# EAGLE schematic Colour sorting device PCB schematic (EAGLE 9.7.0)
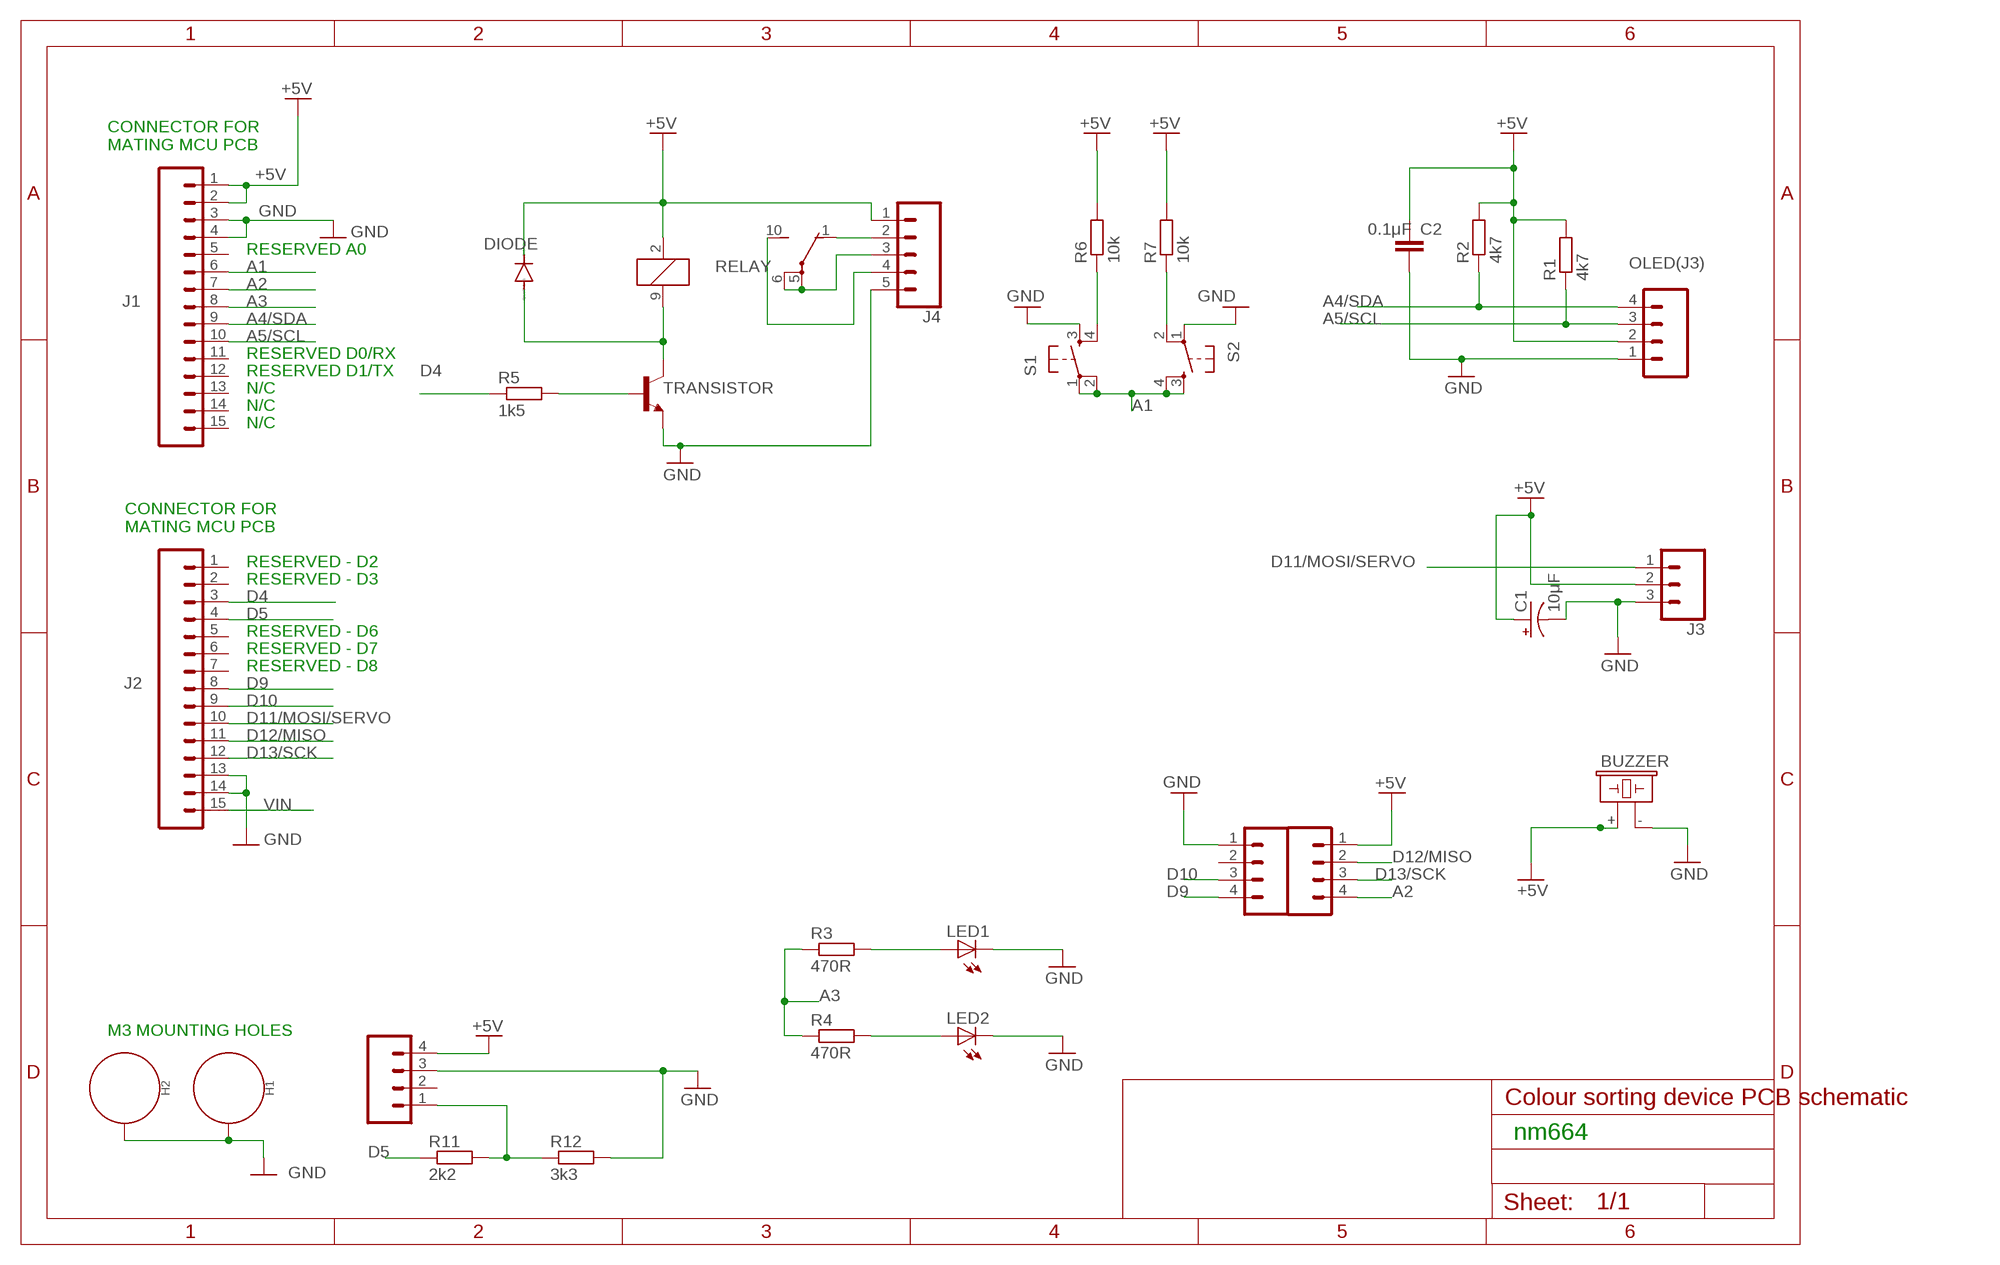
[diagram p0: schematic, sheet 1]

## Parts
BLUETOOTH  1X04_SMD_STRAIGHT_COMBO  CONN_04LONGPADS  [1X04_LONGPADS]
BUZZER  EL311_ATMEGA_INTRO_TSC033_V1_BUZZER_F/CM12P  [EL311_ATMEGA_INTRO_TSC033_V1_BUZZER_F/CM12P]
C1  10μF  CPOL-USE3.5-8  [E3,5-8]
C2  0.1μF  CAPACITOR-WIMA_C2.5/2  [CAPACITOR-WIMA_C2.5-2]
DIODE  DIODE_1N4004  [DIODE_DO41-10]
H1  STANDOFF_ELECTRICAL  [STANDOFF-ELECTRICAL]
H2  STANDOFF_ELECTRICAL  [STANDOFF-ELECTRICAL]
J1  CONN_15  [1X15]
J2  CONN_15  [1X15]
J3  1x3 RA Female .1"  CONN_03LONGPADS  [1X03_LONGPADS]
J4  CONN_05PTH_LONGPADS  [1X05_LONGPADS]
J5  1X04_SMD_STRAIGHT_COMBO  CONN_04LONGPADS  [1X04_LONGPADS]
LED1  ADAFRUIT_LED3MM  [ADAFRUIT_LED3MM]
LED2  ADAFRUIT_LED3MM  [ADAFRUIT_LED3MM]
OLED(J3)  1X04_SMD_STRAIGHT_COMBO  CONN_04LONGPADS  [1X04_LONGPADS]
R1  4k7  R-EU_0207/10  [0207/10]
R2  4k7  R-EU_0207/10  [0207/10]
R3  470R  R-EU_0207/10  [0207/10]
R4  470R  R-EU_0207/10  [0207/10]
R5  1k5  R-EU_0207/10  [0207/10]
R6  10k  R-EU_0207/10  [0207/10]
R7  10k  R-EU_0207/10  [0207/10]
R11  2k2  R-EU_0207/10  [0207/10]
R12  3k3  R-EU_0207/10  [0207/10]
RELAY  RELAY_G5V1  [RELAY_G5V1]
S1  EL311-ROBOT_SPARKFUN-ELECTROMECHANICAL_TAC_SWITCHPTH  [EL311-ROBOT_SPARKFUN-ELECTROMECHANICAL_TACTILE-PTH]
S2  EL311-ROBOT_SPARKFUN-ELECTROMECHANICAL_TAC_SWITCHPTH  [EL311-ROBOT_SPARKFUN-ELECTROMECHANICAL_TACTILE-PTH]
SENSORCONN1  1X04_SMD_STRAIGHT_COMBO  CONN_04LONGPADS  [1X04_LONGPADS]
TRANSISTOR  -NPN-TO92-EBC  [TO92-EBC]

## Nets
+5V [Power2]: BLUETOOTH.4 BUZZER.+ C1.+ C2.1 DIODE.C J1.1 J1.2 J3.2 J4.1 J5.1 OLED(J3).2 R1.2 R2.2 R6.2 R7.2 RELAY.2
A1: J1.6 S1.1 S1.2 S2.3 S2.4
A2: J1.7 J5.4
A3: J1.8 R3.1 R4.1
A4/SDA: J1.9 OLED(J3).4 R2.1
A5/SCL: J1.10 OLED(J3).3 R1.1
D4: J2.3 R5.1
D5: J2.4 R11.1
D9: J2.8 SENSORCONN1.4
D10: J2.9 SENSORCONN1.3
D11/MOSI/SERVO: J2.10 J3.1
D12/MISO: J2.11 J5.2
D13/SCK: J2.12 J5.3
GND [Power2]: BLUETOOTH.3 BUZZER.- C1.- C2.2 H1.P1 H2.P1 J1.3 J1.4 J2.13 J2.14 J3.3 J4.5 LED1.K(C) LED2.K(C) OLED(J3).1 R12.2 S1.3 S2.1 SENSORCONN1.1 TRANSISTOR.E
N$3: LED1.A R3.2
N$4: R5.2 TRANSISTOR.B
N$5: LED2.A R4.2
N$8: J4.4 RELAY.10(2:S)
N$9: J4.3 RELAY.5(2:P) RELAY.6(2:P)
N$10: J4.2 RELAY.1(2:O)
N$11: R6.1 S1.4
N$12: R7.1 S2.2
N$16: BLUETOOTH.1 R11.2 R12.1
N$17: DIODE.A RELAY.9 TRANSISTOR.C
VIN [Power2]: J2.15
Unconnected: BLUETOOTH.2 J1.5 J1.11 J1.12 J1.13 J1.14 J1.15 J2.1 J2.2 J2.5 J2.6 J2.7 SENSORCONN1.2

## Notes on the sheet
- CONNECTOR FOR
  MATING MCU PCB
- RESERVED A0
- RESERVED D0/RX
- RESERVED D1/TX
- N/C
- N/C
- N/C
- CONNECTOR FOR
  MATING MCU PCB
- RESERVED - D2
- RESERVED - D3
- RESERVED - D6
- RESERVED - D7
- RESERVED - D8
- M3 MOUNTING HOLES
- nm664

## Library data of the parts
BLUETOOTH J5 OLED(J3) SENSORCONN1 = EENG3110_V2_Library:CONN_04: Multi connection point. Often used as Generic Header-pin footprint for 0.1 inch spaced/style header connections On any of the 0.1 inch spaced packages, you can populate with these: Break Away Headers - Straight <https://www.sparkfun.com/products/116> (PRT-00116) Break Away Male Headers - Right Angle <https://www.sparkfun.com/products/553> (PRT-00553) Female Headers <https://www.sparkfun.com/products/115> (PRT-00115) Break Away Headers - Machine Pin <https://www.sparkfun.com/products/117> (PRT-00117) Break Away Female Headers - Swiss Machine Pin <https://www.sparkfun.com/products/743> (PRT-00743) For SCREWTERMINALS and SPRING TERMINALS visit here: Screw Terimnals on SparkFun.com <https://www.sparkfun.com/search/results?term=Screw+Terminals> (5mm/3.5mm/2.54mm spacing) This device is also useful as a general connection point to wire up your design to another part of your project. Our various solder wires solder well into these plated through hole pads. Hook-Up Wire - Assortment (Stranded, 22 AWG) <https://www.sparkfun.com/products/11375> (PRT-11375) Hook-Up Wire - Assortment (Solid Core, 22 AWG) <https://www.sparkfun.com/products/11367> (PRT-11367) View the entire wire category on our website here <https://www.sparkfun.com/categories/141> Special notes: Molex polarized connector foot print use with SKU : PRT-08231 with associated crimp pins and housings. 1MM SMD Version SKU: PRT-10208; PROD_ID: CONN-08511; SF_ID: PRT-12638
BUZZER = EENG3110_V2_Library:EL311_ATMEGA_INTRO_TSC033_V1_BUZZER_F/CM12P: BUZZER Source: Buerklin; OC_FARNELL: unknown; OC_NEWARK: unknown
C1 = EENG3110_V2_Library:CPOL-US: POLARIZED CAPACITOR, American symbol
C2 = EENG3110_V2_Library:CAPACITOR-WIMA_C: CAPACITOR naming: grid - package width
DIODE = EENG3110_V2_Library:DIODE_1N4004: DIODE general purpose rectifier, 1 A
H1 H2 = SparkFun-Hardware:STANDOFF_ELECTRICAL: Stand Off Drill holes with an electrical connection. For example, use these to ground your board to a chassis. Example SparkFun Products Screw - Phillips Head (1/4", 4-40, 10 pack) <https://www.sparkfun.com/products/10453> (PRT-10453) Screw - Phillips Head (1/2", 4-40, 10 pack) <https://www.sparkfun.com/products/10452> (PRT-10452) Screw - Phillips Head (3/4", 4-40, 10 pack) <https://www.sparkfun.com/products/10451> (PRT-10451) Screw - Phillips Head (1", 4-40, 10 pack) <https://www.sparkfun.com/products/10450> (PRT-10450)
J1 J2 = SparkFun-Connectors:CONN_15: Multi connection point. Often used as Generic Header-pin footprint for 0.1 inch spaced/style header connections On any of the 0.1 inch spaced packages, you can populate with these: Break Away Headers - Straight <https://www.sparkfun.com/products/116> (PRT-00116) Break Away Male Headers - Right Angle <https://www.sparkfun.com/products/553> (PRT-00553) Female Headers <https://www.sparkfun.com/products/115> (PRT-00115) Break Away Headers - Machine Pin <https://www.sparkfun.com/products/117> (PRT-00117) Break Away Female Headers - Swiss Machine Pin <https://www.sparkfun.com/products/743> (PRT-00743) For SCREWTERMINALS and SPRING TERMINALS visit here: Screw Terimnals on SparkFun.com <https://www.sparkfun.com/search/results?term=Screw+Terminals> (5mm/3.5mm/2.54mm spacing) This device is also useful as a general connection point to wire up your design to another part of your project. Our various solder wires solder well into these plated through hole pads. Hook-Up Wire - Assortment (Stranded, 22 AWG) <https://www.sparkfun.com/products/11375> (PRT-11375) Hook-Up Wire - Assortment (Solid Core, 22 AWG) <https://www.sparkfun.com/products/11367> (PRT-11367) View the entire wire category on our website here <https://www.sparkfun.com/categories/141> Special notes: Molex polarized connector foot print use with SKU : PRT-08231 with associated crimp pins and housings. 1MM SMD Version SKU: PRT-10208 NOTES ON THE VARIANTS LOCK and LOCK_LONGPADS... This footprint was designed to help hold the alignment of a through-hole component (i.e. 6-pin header) while soldering it into place. You may notice that each hole has been shifted either up or down by 0.005 of an inch from it's more standard position (which is a perfectly straight line). This slight alteration caused the pins (the squares in the middle) to touch the edges of the holes. Because they are alternating, it causes a "brace" to hold the component in place. 0.005 has proven to be the perfect amount of "off-center" position when using our standard breakaway headers. Although looks a little odd when you look at the bare footprint, once you have a header in there, the alteration is very hard to notice. Also,if you push a header all the way into place, it is covered up entirely on the bottom side.
J3 = EENG3110_V2_Library:CONN_03: Multi connection point. Often used as Generic Header-pin footprint for 0.1 inch spaced/style header connections On any of the 0.1 inch spaced packages, you can populate with these: Break Away Headers - Straight <https://www.sparkfun.com/products/116> (PRT-00116) Break Away Male Headers - Right Angle <https://www.sparkfun.com/products/553> (PRT-00553) Female Headers <https://www.sparkfun.com/products/115> (PRT-00115) Break Away Headers - Machine Pin <https://www.sparkfun.com/products/117> (PRT-00117) Break Away Female Headers - Swiss Machine Pin <https://www.sparkfun.com/products/743> (PRT-00743) Stackable Header - 3 Pin (Female, 0.1") <https://www.sparkfun.com/products/13875> (PRT-13875) For SCREWTERMINALS and SPRING TERMINALS visit here: Screw Terimnals on SparkFun.com <https://www.sparkfun.com/search/results?term=Screw+Terminals> (5mm/3.5mm/2.54mm spacing) This device is also useful as a general connection point to wire up your design to another part of your project. Our various solder wires solder well into these plated through hole pads. Hook-Up Wire - Assortment (Stranded, 22 AWG) <https://www.sparkfun.com/products/11375> (PRT-11375) Hook-Up Wire - Assortment (Solid Core, 22 AWG) <https://www.sparkfun.com/products/11367> (PRT-11367) View the entire wire category on our website here <https://www.sparkfun.com/categories/141> Special notes: Molex polarized connector foot print use with SKU : PRT-08232 with associated crimp pins and housings.; PROD_ID: CONN-10925; SF_ID: PRT-08235; SF_SKU: PRT-08433
J4 = EENG3110_V2_Library:CONN_05: Multi connection point. Often used as Generic Header-pin footprint for 0.1 inch spaced/style header connections On any of the 0.1 inch spaced packages, you can populate with these: Break Away Headers - Straight <https://www.sparkfun.com/products/116> (PRT-00116) Break Away Male Headers - Right Angle <https://www.sparkfun.com/products/553> (PRT-00553) Female Headers <https://www.sparkfun.com/products/115> (PRT-00115) Break Away Headers - Machine Pin <https://www.sparkfun.com/products/117> (PRT-00117) Break Away Female Headers - Swiss Machine Pin <https://www.sparkfun.com/products/743> (PRT-00743) For SCREWTERMINALS and SPRING TERMINALS visit here: Screw Terimnals on SparkFun.com <https://www.sparkfun.com/search/results?term=Screw+Terminals> (5mm/3.5mm/2.54mm spacing) This device is also useful as a general connection point to wire up your design to another part of your project. Our various solder wires solder well into these plated through hole pads. Hook-Up Wire - Assortment (Stranded, 22 AWG) <https://www.sparkfun.com/products/11375> (PRT-11375) Hook-Up Wire - Assortment (Solid Core, 22 AWG) <https://www.sparkfun.com/products/11367> (PRT-11367) View the entire wire category on our website here <https://www.sparkfun.com/categories/141> Special notes: Molex polarized connector foot print use with SKU : PRT-08231 with associated crimp pins and housings. 1MM SMD Version SKU: PRT-10208; PROD_ID: CONN-08528; SF_ID: GPS-08288
LED1 LED2 = EENG3110_V2_Library:ADAFRUIT_LED: LED OSRAM: - CHIPLED LG R971, LG N971, LY N971, LG Q971, LY Q971, LO R971, LY R971 LH N974, LH R974 LS Q976, LO Q976, LY Q976 LO Q996 - Hyper CHIPLED LW Q18S LB Q993, LB Q99A, LB R99A - SideLED LS A670, LO A670, LY A670, LG A670, LP A670 LB A673, LV A673, LT A673, LW A673 LH A674 LY A675 LS A676, LA A676, LO A676, LY A676, LW A676 LS A679, LY A679, LG A679 - Hyper Micro SIDELED® LS Y876, LA Y876, LO Y876, LY Y876 LT Y87S - SmartLED LW L88C, LW L88S LB L89C, LB L89S, LG L890 LS L89K, LO L89K, LY L89K LS L896, LA L896, LO L896, LY L896 - TOPLED LS T670, LO T670, LY T670, LG T670, LP T670 LSG T670, LSP T670, LSY T670, LOP T670, LYG T670 LG T671, LOG T671, LSG T671 LB T673, LV T673, LT T673, LW T673 LH T674 LS T676, LA T676, LO T676, LY T676, LB T676, LH T676, LSB T676, LW T676 LB T67C, LV T67C, LT T67C, LS T67K, LO T67K, LY T67K, LW E67C LS E67B, LA E67B, LO E67B, LY E67B, LB E67C, LV E67C, LT E67C LW T67C LS T679, LY T679, LG T679 LS T770, LO T770, LY T770, LG T770, LP T770 LB T773, LV T773, LT T773, LW T773 LH T774 LS E675, LA E675, LY E675, LS T675 LS T776, LA T776, LO T776, LY T776, LB T776 LHGB T686 LT T68C, LB T68C - Hyper Mini TOPLED® LB M676 - Mini TOPLED Santana® LG M470 LS M47K, LO M47K, LY M47K Source: http://www.osram.convergy.de/
R1-R7 R11 R12 = EENG3110_V2_Library:R-EU_: RESISTOR, European symbol
RELAY = EENG3110_V2_Library:RELAY_G5V1: RELAY 1 x switch, 0.5 A/125 V AC, 1 A/24 V DC , Omron; MPN: G5V-1-DC24; OC_FARNELL: 9949593; OC_NEWARK: 36M6377
S1 S2 = EENG3110_V2_Library:EL311-ROBOT_SPARKFUN-ELECTROMECHANICAL_TAC_SWITCH: Momentary Switch Button commonly used for reset or general input. Spark Fun Electronics SKU : COM-00097 SMT- SWCH-08247
TRANSISTOR = EENG3110_V2_Library:*-NPN-: NPN Transistror

## Net classes
2 Power2: width 0.635 mm